# Altium schematic sheet A7_FUNCTION2.SchDoc
size A3
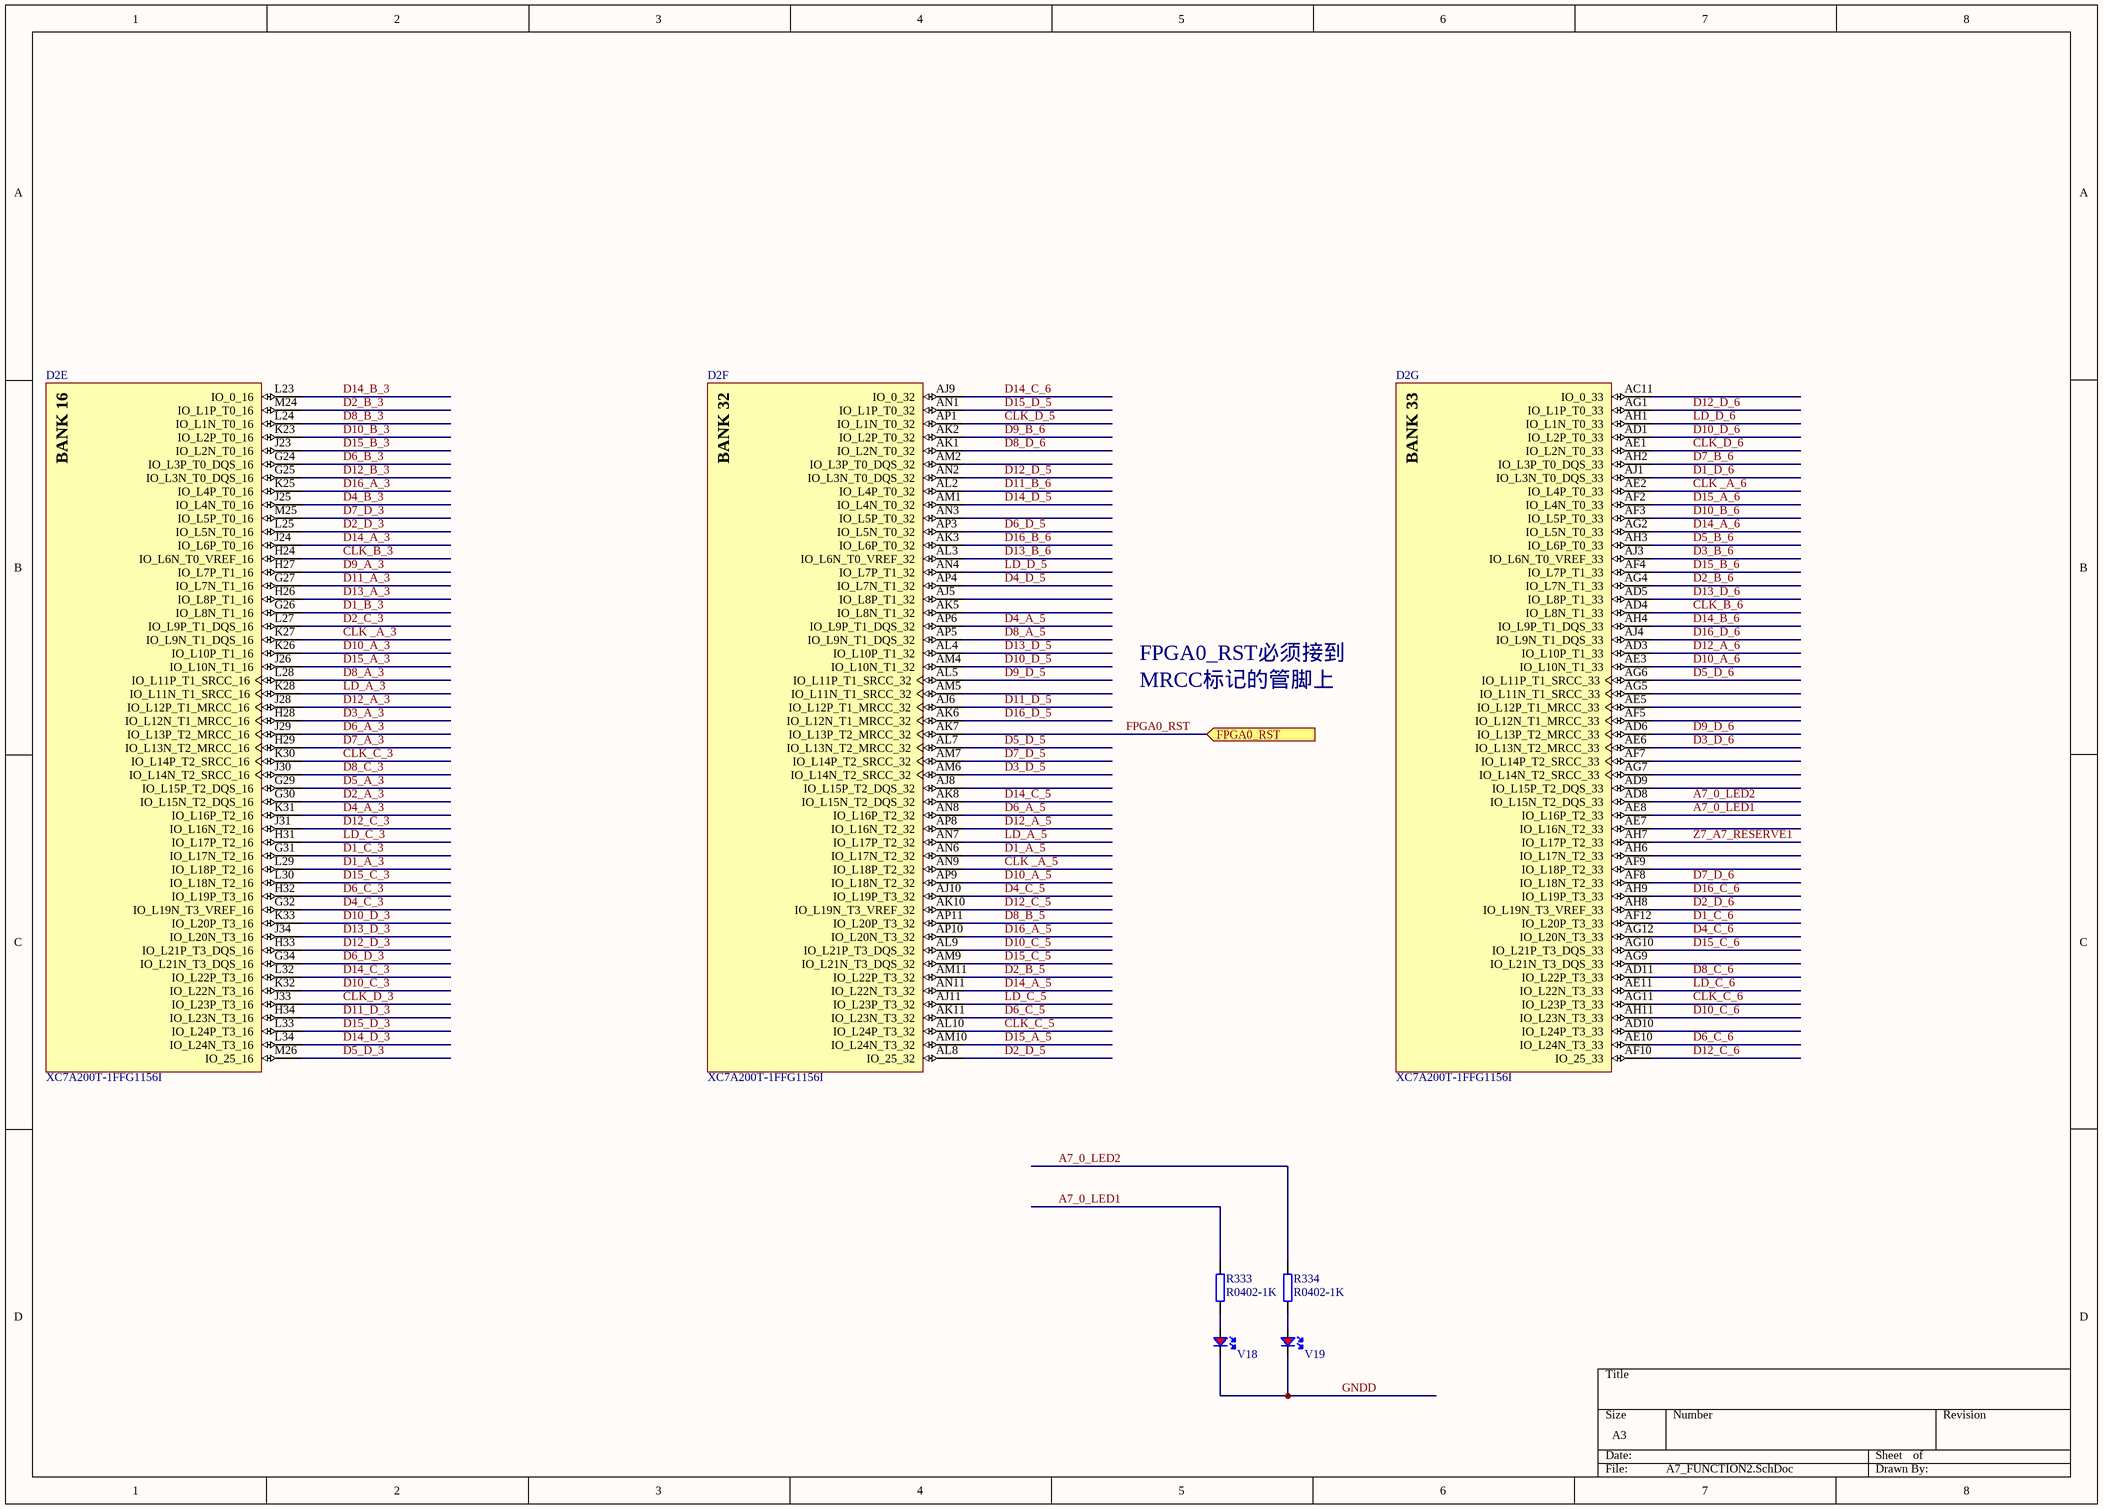
[diagram p0: A7_FUNCTION2.SchDoc]

## Parts
D2  XC7A200T-1FFG1156I  [FFG1156]  (parts E,F,G of 18)
R333  R0402-1K  [R0402]
R334  R0402-1K  [R0402]
V18  LED-R0603  [LED-R0603]  (value not drawn)
V19  LED-R0603  [LED-R0603]  (value not drawn)

## Ports
FPGA0_RST (in)

## Nets
A7_0_LED1: D2.AE8(IO_L16P_T2_33) R333.2
A7_0_LED2: D2.AD8(IO_L15N_T2_DQS_33) R334.2
CLK _A_3: D2.K27(IO_L9N_T1_DQS_16)
CLK _A_5: D2.AN9(IO_L18P_T2_32)
CLK _A_6: D2.AE2(IO_L4P_T0_33)
CLK_B_3: D2.H24(IO_L6N_T0_VREF_16)
CLK_B_6: D2.AD4(IO_L8N_T1_33)
CLK_C_3: D2.K30(IO_L14P_T2_SRCC_16)
CLK_C_5: D2.AL10(IO_L24P_T3_32)
CLK_C_6: D2.AG11(IO_L23P_T3_33)
CLK_D_3: D2.J33(IO_L23P_T3_16)
CLK_D_5: D2.AP1(IO_L1N_T0_32)
CLK_D_6: D2.AE1(IO_L2N_T0_33)
D1_A_3: D2.L29(IO_L18P_T2_16)
D1_A_5: D2.AN6(IO_L17N_T2_32)
D1_B_3: D2.G26(IO_L8N_T1_16)
D1_C_3: D2.G31(IO_L17N_T2_16)
D1_C_6: D2.AF12(IO_L20P_T3_33)
D1_D_6: D2.AJ1(IO_L3N_T0_DQS_33)
D2_A_3: D2.G30(IO_L15N_T2_DQS_16)
D2_B_3: D2.M24(IO_L1P_T0_16)
D2_B_5: D2.AM11(IO_L22P_T3_32)
D2_B_6: D2.AG4(IO_L7N_T1_33)
D2_C_3: D2.L27(IO_L9P_T1_DQS_16)
D2_D_3: D2.L25(IO_L5N_T0_16)
D2_D_5: D2.AL8(IO_25_32)
D2_D_6: D2.AH8(IO_L19N_T3_VREF_33)
D3_A_3: D2.H28(IO_L12N_T1_MRCC_16)
D3_B_6: D2.AJ3(IO_L6N_T0_VREF_33)
D3_D_5: D2.AM6(IO_L14N_T2_SRCC_32)
D3_D_6: D2.AE6(IO_L13N_T2_MRCC_33)
D4_A_3: D2.K31(IO_L16P_T2_16)
D4_A_5: D2.AP6(IO_L9P_T1_DQS_32)
D4_B_3: D2.J25(IO_L4N_T0_16)
D4_C_3: D2.G32(IO_L19N_T3_VREF_16)
D4_C_5: D2.AJ10(IO_L19P_T3_32)
D4_C_6: D2.AG12(IO_L20N_T3_33)
D4_D_5: D2.AP4(IO_L7N_T1_32)
D5_A_3: D2.G29(IO_L15P_T2_DQS_16)
D5_B_6: D2.AH3(IO_L6P_T0_33)
D5_D_3: D2.M26(IO_25_16)
D5_D_5: D2.AL7(IO_L13N_T2_MRCC_32)
D5_D_6: D2.AG6(IO_L11P_T1_SRCC_33)
D6_A_3: D2.J29(IO_L13P_T2_MRCC_16)
D6_A_5: D2.AN8(IO_L16P_T2_32)
D6_B_3: D2.G24(IO_L3P_T0_DQS_16)
D6_C_3: D2.H32(IO_L19P_T3_16)
D6_C_5: D2.AK11(IO_L23N_T3_32)
D6_C_6: D2.AE10(IO_L24N_T3_33)
D6_D_3: D2.G34(IO_L21N_T3_DQS_16)
D6_D_5: D2.AP3(IO_L5N_T0_32)
D7_A_3: D2.H29(IO_L13N_T2_MRCC_16)
D7_B_6: D2.AH2(IO_L3P_T0_DQS_33)
D7_D_3: D2.M25(IO_L5P_T0_16)
D7_D_5: D2.AM7(IO_L14P_T2_SRCC_32)
D7_D_6: D2.AF8(IO_L18N_T2_33)
D8_A_3: D2.L28(IO_L11P_T1_SRCC_16)
D8_A_5: D2.AP5(IO_L9N_T1_DQS_32)
D8_B_3: D2.L24(IO_L1N_T0_16)
D8_B_5: D2.AP11(IO_L20P_T3_32)
D8_C_3: D2.J30(IO_L14N_T2_SRCC_16)
D8_C_6: D2.AD11(IO_L22P_T3_33)
D8_D_6: D2.AK1(IO_L2N_T0_32)
D9_A_3: D2.H27(IO_L7P_T1_16)
D9_B_6: D2.AK2(IO_L2P_T0_32)
D9_D_5: D2.AL5(IO_L11P_T1_SRCC_32)
D9_D_6: D2.AD6(IO_L13P_T2_MRCC_33)
D10_A_3: D2.K26(IO_L10P_T1_16)
D10_A_5: D2.AP9(IO_L18N_T2_32)
D10_A_6: D2.AE3(IO_L10N_T1_33)
D10_B_3: D2.K23(IO_L2P_T0_16)
D10_B_6: D2.AF3(IO_L5P_T0_33)
D10_C_3: D2.K32(IO_L22N_T3_16)
D10_C_5: D2.AL9(IO_L21P_T3_DQS_32)
D10_C_6: D2.AH11(IO_L23N_T3_33)
D10_D_3: D2.K33(IO_L20P_T3_16)
D10_D_5: D2.AM4(IO_L10N_T1_32)
D10_D_6: D2.AD1(IO_L2P_T0_33)
D11_A_3: D2.G27(IO_L7N_T1_16)
D11_B_6: D2.AL2(IO_L4P_T0_32)
D11_D_3: D2.H34(IO_L23N_T3_16)
D11_D_5: D2.AJ6(IO_L12P_T1_MRCC_32)
D12_A_3: D2.J28(IO_L12P_T1_MRCC_16)
D12_A_5: D2.AP8(IO_L16N_T2_32)
D12_A_6: D2.AD3(IO_L10P_T1_33)
D12_B_3: D2.G25(IO_L3N_T0_DQS_16)
D12_C_3: D2.J31(IO_L16N_T2_16)
D12_C_5: D2.AK10(IO_L19N_T3_VREF_32)
D12_C_6: D2.AF10(IO_25_33)
D12_D_3: D2.H33(IO_L21P_T3_DQS_16)
D12_D_5: D2.AN2(IO_L3N_T0_DQS_32)
D12_D_6: D2.AG1(IO_L1P_T0_33)
D13_A_3: D2.H26(IO_L8P_T1_16)
D13_B_6: D2.AL3(IO_L6N_T0_VREF_32)
D13_D_3: D2.J34(IO_L20N_T3_16)
D13_D_5: D2.AL4(IO_L10P_T1_32)
D13_D_6: D2.AD5(IO_L8P_T1_33)
D14_A_3: D2.J24(IO_L6P_T0_16)
D14_A_5: D2.AN11(IO_L22N_T3_32)
D14_A_6: D2.AG2(IO_L5N_T0_33)
D14_B_3: D2.L23(IO_0_16)
D14_B_6: D2.AH4(IO_L9P_T1_DQS_33)
D14_C_3: D2.L32(IO_L22P_T3_16)
D14_C_5: D2.AK8(IO_L15N_T2_DQS_32)
D14_C_6: D2.AJ9(IO_0_32)
D14_D_3: D2.L34(IO_L24N_T3_16)
D14_D_5: D2.AM1(IO_L4N_T0_32)
D15_A_3: D2.J26(IO_L10N_T1_16)
D15_A_5: D2.AM10(IO_L24N_T3_32)
D15_A_6: D2.AF2(IO_L4N_T0_33)
D15_B_3: D2.J23(IO_L2N_T0_16)
D15_B_6: D2.AF4(IO_L7P_T1_33)
D15_C_3: D2.L30(IO_L18N_T2_16)
D15_C_5: D2.AM9(IO_L21N_T3_DQS_32)
D15_C_6: D2.AG10(IO_L21P_T3_DQS_33)
D15_D_3: D2.L33(IO_L24P_T3_16)
D15_D_5: D2.AN1(IO_L1P_T0_32)
D16_A_3: D2.K25(IO_L4P_T0_16)
D16_A_5: D2.AP10(IO_L20N_T3_32)
D16_B_6: D2.AK3(IO_L6P_T0_32)
D16_C_6: D2.AH9(IO_L19P_T3_33)
D16_D_5: D2.AK6(IO_L12N_T1_MRCC_32)
D16_D_6: D2.AJ4(IO_L9N_T1_DQS_33)
FPGA0_RST: D2.AK7(IO_L13P_T2_MRCC_32) ; port FPGA0_RST
GNDD: V18.2(K) V19.2(K)
LD_A_3: D2.K28(IO_L11N_T1_SRCC_16)
LD_A_5: D2.AN7(IO_L17P_T2_32)
LD_C_3: D2.H31(IO_L17P_T2_16)
LD_C_5: D2.AJ11(IO_L23P_T3_32)
LD_C_6: D2.AE11(IO_L22N_T3_33)
LD_D_5: D2.AN4(IO_L7P_T1_32)
LD_D_6: D2.AH1(IO_L1N_T0_33)
Z7_A7_RESERVE1: D2.AH7(IO_L17P_T2_33)
NetR333_1: R333.1 V18.1(A)
NetR334_1: R334.1 V19.1(A)

Not connected (* = marked no-connect by the designer): D2 AC11(IO_0_33) AD9(IO_L15P_T2_DQS_33) AD10(IO_L24P_T3_33) AE5(IO_L12P_T1_MRCC_33) AE7(IO_L16N_T2_33) AF5(IO_L12N_T1_MRCC_33) AF7(IO_L14P_T2_SRCC_33) AF9(IO_L18P_T2_33) AG5(IO_L11N_T1_SRCC_33) AG7(IO_L14N_T2_SRCC_33) AG9(IO_L21N_T3_DQS_33) AH6(IO_L17N_T2_33) AJ5(IO_L8P_T1_32) AJ8(IO_L15P_T2_DQS_32) AK5(IO_L8N_T1_32) AM2(IO_L3P_T0_DQS_32) AM5(IO_L11N_T1_SRCC_32) AN3(IO_L5P_T0_32)

## Notes on the sheet
- FPGA0_RST必须接到
- MRCC标记的管脚上
- (in symbol XC7A200T-1FFG1156I, part E) BANK 16
- (in symbol XC7A200T-1FFG1156I, part F) BANK 32
- (in symbol XC7A200T-1FFG1156I, part G) BANK 33

## Library data of the parts
D2 = XC7A200T-1FFG1156I: Artix-7 FPGA, 500 User I/Os, 16 GTP, 1156-Ball BGA, Speed Grade 1, Industrial Grade, Pb-Free; Manufacturer: Xilinx; Block RAM Blocks (18Kb): 730; Block RAM Blocks (36Kb): 365; Block RAM Blocks (Max Kb): 13140; CLBs (Slices): 33650; Clock Mgmt Tiles (CMTs): 10; DSP48E1 Slices: 740; Logic Cells: 215360; Max User I/O: 500; Speed Grade: -1; DatasheetVersion: v1.12; PackageVersion: Rev 1.8; PackageReference: FFG1156; PackageDescription: Flip-Chip BGA, Body 35 x 35 mm, 1.0 mm Pitch; CLBs (Max Distributed RAM Kb): 2888; Generic Part Number: XC7A200T; RoHS: Pb-Free; Mounting Technology: Surface Mount; Code_JEDEC: MS-034-AAR-1; PartNumber: XC7A200T-1FFG1156I; ComponentLink1Description: Datasheet; ComponentLink1URL: http://www.xilinx.com/support/documentation/data_sheets/ds180_7Series_Overview.pdf; ComponentLink2Description: Package Specification; ComponentLink2URL: http://www.xilinx.com/support/documentation/user_guides/ug475_7Series_Pkg_Pinout.pdf; ComponentLink3Description: DC and Switching Characteristics; ComponentLink3URL: http://www.xilinx.com/support/documentation/data_sheets/ds181_Artix_7_Data_Sheet.pdf; ComponentLink4Description: Package File; ComponentLink4URL: http://www.xilinx.com/support/packagefiles/a7packages/xc7a200tfbg676pkg.txt; ComponentLink5Description: Packaging and Pinout; ComponentLink5URL: http://www.xilinx.com/support/documentation/user_guides/ug475_7Series_Pkg_Pinout.pdf
R333 R334 = R0402-10K: Manufacturer: SAMSUNG; Part_number: R0402-1K; Part_type: RES; Value: R0402-1K; Schematic_Part: RES; PCB_Footprint: R0402
V18 V19 = LED-R0603: 表贴发光二极管, 0603封装, 体积1.6x0.8mm, 红色, 高度0.8mm; Part_type: DIODES; Part_number: LED-R0603; Value: LED-R0603; Schematic_Part: LED-R; PCB_Footprint: LED-R0603